# EAGLE design LampBoo (EAGLE 7.7.0)
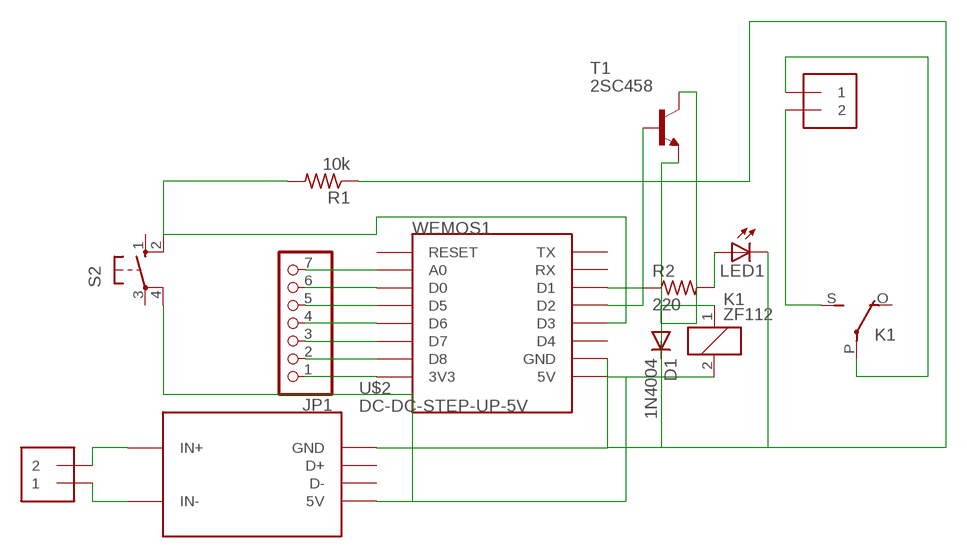
[diagram p0: schematic, sheet 1]

## Parts
D1  1N4004  [DO41-10]
J1  1X2-3.5MM  [1X2-3.5MM]
J2  1X2-3.5MM  [1X2-3.5MM]
JP1  PINHD-1X7  [1X07]
K1  ZF112  [ZF112]
LED1  LED3MM  [LED3MM]
R1  10k  R-US_0204/7  [0204/7]
R2  220  R-US_0204/7  [0204/7]
S2  10-XX  [B3F-10XX]
T1  2SC458  [TO92-ECB]
U$2  DC-DC-STEP-UP-5V  [DC-DC-STEP-UP-5V]
WEMOS1  WEMOS-D1-MINI  [WEMOS-D1-MINI]

## Nets
N$1: D1.C K1.2 S2.4(P1) U$2.5V WEMOS1.5V
N$2: R2.1 WEMOS1.D2
N$3: LED1.A R2.2
N$4: JP1.1 WEMOS1.3V3
N$5: JP1.2 WEMOS1.D8
N$6: J1.2 K1.S(2:S)
N$7: J1.1 K1.P(2:P)
N$8: LED1.K(C) R1.1 T1.E U$2.GND WEMOS1.GND
N$9: R1.2 S2.2(S1) WEMOS1.D3
N$10: J2.2 U$2.IN+
N$11: J2.1 U$2.IN-
N$12: JP1.3 WEMOS1.D7
N$13: JP1.4 WEMOS1.D6
N$14: JP1.5 WEMOS1.D5
N$15: JP1.6 WEMOS1.D0
N$16: JP1.7 WEMOS1.A0
N$20: D1.A K1.1 T1.C
N$21: T1.B WEMOS1.D1
Unconnected: K1.O(2:O) S2.1(S) S2.3(P) U$2.D+ U$2.D- WEMOS1.D4 WEMOS1.RESET WEMOS1.RX WEMOS1.TX

## Library data of the parts
D1 = adafruit:1N4004: DIODE General purpose 1N400x type rectifier (With bigger pads) http://www.ladyada.net/library/pcb/eaglelibrary.html
J1 J2 = adafruit:1X2: 3.5mm Terminal block http://www.ladyada.net/library/pcb/eaglelibrary.html
JP1 = pinhead:PINHD-1X7: PIN HEADER
K1 = relay:ZF112: RELAY 1 x switch; OC_FARNELL: unknown; OC_NEWARK: unknown
LED1 = led:LED: LED OSRAM: - CHIPLED LG R971, LG N971, LY N971, LG Q971, LY Q971, LO R971, LY R971 LH N974, LH R974 LS Q976, LO Q976, LY Q976 LO Q996 - Hyper CHIPLED LW Q18S LB Q993, LB Q99A, LB R99A - SideLED LS A670, LO A670, LY A670, LG A670, LP A670 LB A673, LV A673, LT A673, LW A673 LH A674 LY A675 LS A676, LA A676, LO A676, LY A676, LW A676 LS A679, LY A679, LG A679 - Hyper Micro SIDELED® LS Y876, LA Y876, LO Y876, LY Y876 LT Y87S - SmartLED LW L88C, LW L88S LB L89C, LB L89S, LG L890 LS L89K, LO L89K, LY L89K LS L896, LA L896, LO L896, LY L896 - TOPLED LS T670, LO T670, LY T670, LG T670, LP T670 LSG T670, LSP T670, LSY T670, LOP T670, LYG T670 LG T671, LOG T671, LSG T671 LB T673, LV T673, LT T673, LW T673 LH T674 LS T676, LA T676, LO T676, LY T676, LB T676, LH T676, LSB T676, LW T676 LB T67C, LV T67C, LT T67C, LS T67K, LO T67K, LY T67K, LW E67C LS E67B, LA E67B, LO E67B, LY E67B, LB E67C, LV E67C, LT E67C LW T67C LS T679, LY T679, LG T679 LS T770, LO T770, LY T770, LG T770, LP T770 LB T773, LV T773, LT T773, LW T773 LH T774 LS E675, LA E675, LY E675, LS T675 LS T776, LA T776, LO T776, LY T776, LB T776 LHGB T686 LT T68C, LB T68C - Hyper Mini TOPLED® LB M676 - Mini TOPLED Santana® LG M470 LS M47K, LO M47K, LY M47K Source: http://www.osram.convergy.de LUXEON: - LUMILED® LXK2-PW12-R00, LXK2-PW12-S00, LXK2-PW14-U00, LXK2-PW14-V00 LXK2-PM12-R00, LXK2-PM12-S00, LXK2-PM14-U00 LXK2-PE12-Q00, LXK2-PE12-R00, LXK2-PE12-S00, LXK2-PE14-T00, LXK2-PE14-U00 LXK2-PB12-K00, LXK2-PB12-L00, LXK2-PB12-M00, LXK2-PB14-N00, LXK2-PB14-P00, LXK2-PB14-Q00 LXK2-PR12-L00, LXK2-PR12-M00, LXK2-PR14-Q00, LXK2-PR14-R00 LXK2-PD12-Q00, LXK2-PD12-R00, LXK2-PD12-S00 LXK2-PH12-R00, LXK2-PH12-S00 LXK2-PL12-P00, LXK2-PL12-Q00, LXK2-PL12-R00 Source: www.luxeon.com KINGBRIGHT: KA-3528ASYC Source: www.kingbright.com
R1 R2 = rcl:R-US_: RESISTOR, American symbol
S2 = switch-omron:10-XX: OMRON SWITCH; MPN: B3F-1000; OC_FARNELL: 176432; OC_NEWARK: 36M3542
T1 = transistor:2SC458: NPN Silicon Epitaxial Planar Transistor Source: SEMTECH ELECTRONICS LTD. ... 2SC458 1.pdf
U$2 = diy-modules:DC-DC-STEP-UP-5V: DC/DC Step-Up Converter
WEMOS1 = esp8266modules:WEMOS-D1-MINI: WeMos.cc D1 mini ESP8266 module

## Board
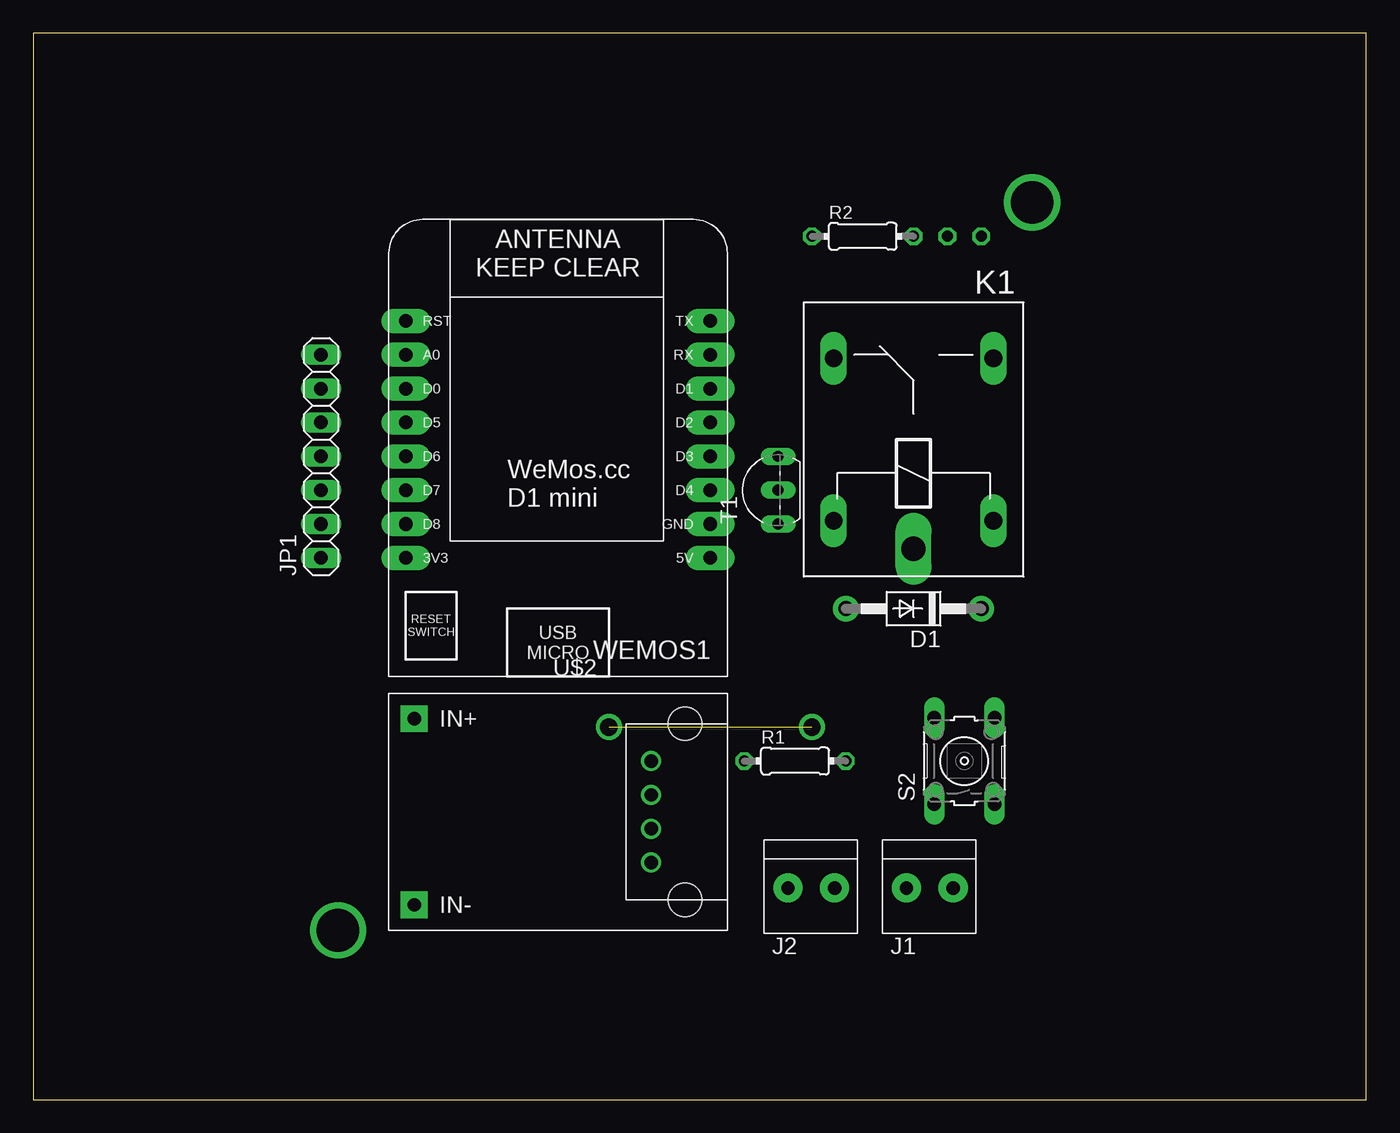
[diagram p1: board, top side]
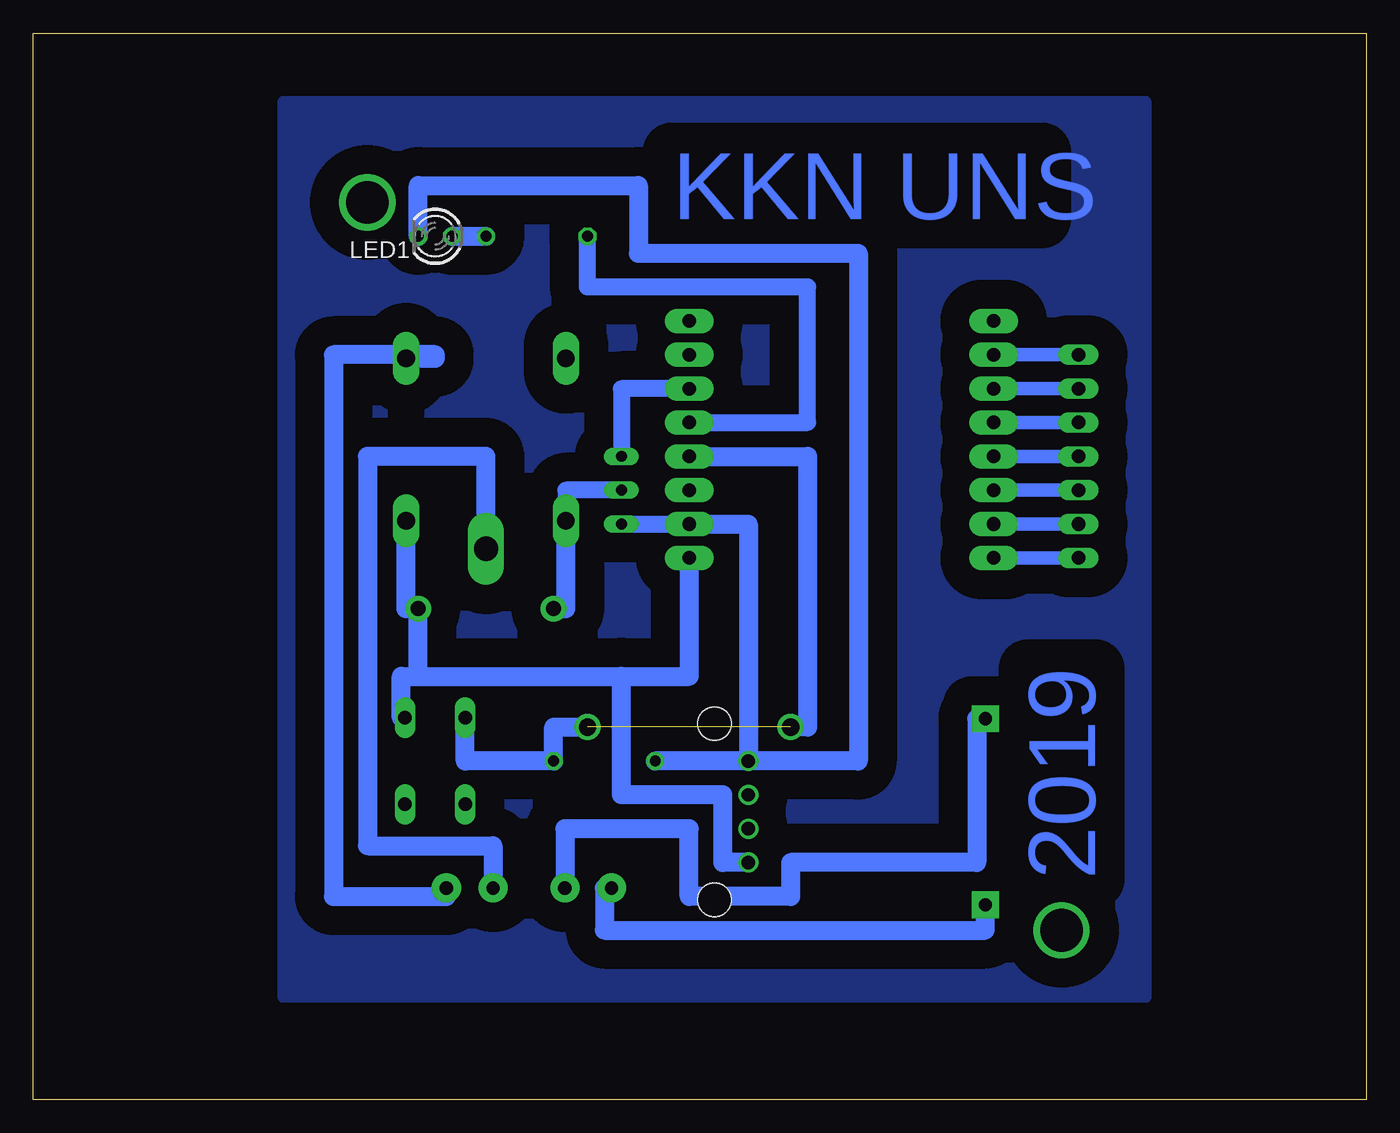
[diagram p2: board, bottom side, seen from below]

Size 100 x 80 mm. Coordinates in mm from the lower left corner, seen from the top.
Outline: 0,0 100,0 100,80 0,80 0,0
Copper layers (1*16): Top 0.035mm / dielectric 1.5mm / Bottom 0.035mm
Design rules "default": minimum track width 10mil, minimum drill 24mil, track to track 8mil, track to pad 8mil, pad to pad 8mil, via to via 8mil, smd to smd 8mil, copper to edge 40mil, drill to drill 8mil, minimum pad ring 10mil, minimum via ring 8mil, stop-mask expansion 4mil, vias tented up to drill 0mil, thermal gap 10mil

### Footprints (pad centres in the part's own frame; a part is rotated, then mirrored left to right if it is on the bottom)
DO41-10 = drill 1.118 pad 1.93: A 5.08,0; C -5.08,0
1X2-3.5MM = drill 1 pad 2.184: 1 1.8,0; 2 -1.7,0
1X07 = drill 1.016 long: 1 -7.62,0; 2 -5.08,0; 3 -2.54,0; 4 0,0; 5 2.54,0; 6 5.08,0; 7 7.62,0
ZF112 = drill 1.321 long: 1 -6.096,5.994; 2 -6.096,-5.994; O 6.096,5.994; S 6.096,-5.994 | drill 1.803 long: P -8.204,0
LED3MM = drill 0.813 octagon: A -1.27,0; K 1.27,0
0204/7 = drill 0.813 octagon: 1 -3.81,0; 2 3.81,0
B3F-10XX = drill 1.016 long: 1 -3.251,2.261; 2 3.251,2.261; 3 -3.251,-2.261; 4 3.251,-2.261
TO92-ECB = drill 0.813 long: B 2.54,0; C 0,0; E -2.54,0
DC-DC-STEP-UP-5V = drill 1: 5V 6.985,-3.81; D+ 6.985,1.27; D- 6.985,-1.27; GND 6.985,3.81 | drill 1 pad 2 square: IN+ -10.795,6.985; IN- -10.795,-6.985 | hole 2.5: 9.525,6.604; 9.525,-6.604
WEMOS-D1-MINI = drill 1.016 pad 1.829 long: 3V3 -10.16,-10.16; 5V 12.7,-10.16; A0 -10.16,5.08; D0 -10.16,2.54; D1 12.7,2.54; D2 12.7,0; D3 12.7,-2.54; D4 12.7,-5.08; D5 -10.16,0; D6 -10.16,-2.54; D7 -10.16,-5.08; D8 -10.16,-7.62; GND 12.7,-7.62; RESET -10.16,7.62; RX 12.7,5.08; TX 12.7,7.62

### Placement (x,y rotation side)
D1  66.04,36.83 180 top
J1  67.31,15.88 180 top
J2  58.42,15.88 180 top
JP1  21.59,48.26 90 top
K1  66.04,49.53 90 top
LED1  69.85,64.77 180 bottom
R1  57.15,25.4 0 top
R2  62.23,64.77 0 top
S2  69.85,25.4 90 top
T1  55.88,45.72 90 top
U$2  39.37,21.59 0 top
WEMOS1  38.1,50.8 0 top

### Tracks (layer width: path | path; a pad name or v marks a point on that pad's centre or on a via)
N$1
  Bottom 1.422: U$2.5V 48.26,17.78 48.26,22.86 55.88,22.86 55.88,31.75 | S2.4 72.39,28.65 72.39,31.75 71.12,31.75 | 55.88,31.75 50.8,31.75 WEMOS1.5V | 71.12,31.75 55.88,31.75 | 71.12,31.75 D1.C 72.03,36.83 K1.2
N$2
  Bottom 1.27: WEMOS1.D2 41.91,50.8 41.91,60.96 58.42,60.96 R2.1
  Bottom 1.422: 49.53,50.8 WEMOS1.D2
N$3
  Bottom 1.422: LED1.A R2.2
N$4
  Bottom 1.016: JP1.1 WEMOS1.3V3
N$5
  Bottom 1.016: JP1.2 WEMOS1.D8
N$6
  Bottom 1.422: J1.2 69.01,15.24 77.47,15.24 77.47,55.88 69.85,55.88 69.85,55.63 K1.S
N$7
  Bottom 1.422: J1.1 65.51,19.05 74.93,19.05 74.93,48.26 66.04,48.26 K1.P
N$8
  Bottom 1.27: T1.E WEMOS1.GND
  Bottom 1.422: U$2.GND R1.1 | WEMOS1.GND 46.35,43.18 U$2.GND | LED1.K 71.12,68.58 54.61,68.58 54.61,63.5 38.1,63.5 38.1,25.4 U$2.GND
N$9  (via drill 1.3)  (1 unrouted)
  Bottom 1.422: S2.2 67.59,25.4 R1.2 60.96,27.94 v58.42,27.94 | WEMOS1.D3 41.91,48.26 41.91,27.94 v43.18,27.94
N$10
  Bottom 1.422: U$2.IN+ 29.21,28.57 29.21,17.78 43.18,17.78 43.18,15.24 50.8,15.24 50.8,20.32 60.12,20.32 J2.2
N$11
  Bottom 1.422: J2.1 57.15,15.88 57.15,12.7 28.57,12.7 U$2.IN-
N$12
  Bottom 1.016: WEMOS1.D7 JP1.3
N$13
  Bottom 1.016: JP1.4 WEMOS1.D6
N$14
  Bottom 1.016: JP1.5 WEMOS1.D5
N$15
  Bottom 1.016: WEMOS1.D0 JP1.6
N$16
  Bottom 1.016: JP1.7 WEMOS1.A0
N$17  (via drill 3.2)
  other vias: 22.86,12.7
N$18  (via drill 3.2)
  other vias: 74.93,67.31
N$19
  pour Bottom (isolate 2.184): 81.28,74.93 16.51,74.93 16.51,7.62 81.28,7.62
N$20
  Bottom 1.27: T1.C 60.05,45.72 K1.1
  Bottom 1.422: D1.A 60.05,36.83 K1.1
N$21
  Bottom 1.27: WEMOS1.D1 55.88,53.34 T1.B

### Text on the board
Bottom: KKN UNS | 2019